# Altium schematic sheet A-03 PWR TREE.SchDoc
size 614 x 462 mm; Address1: 350W 9th Ave; Address2: Suite 206; Address3: Escondido CA 92025; Address4: United States; Revision: -; ENG_APP_DATE: --/--/--; DSN_APP_DATE: --/--/--; CHK_APP_DATE: --/--/--
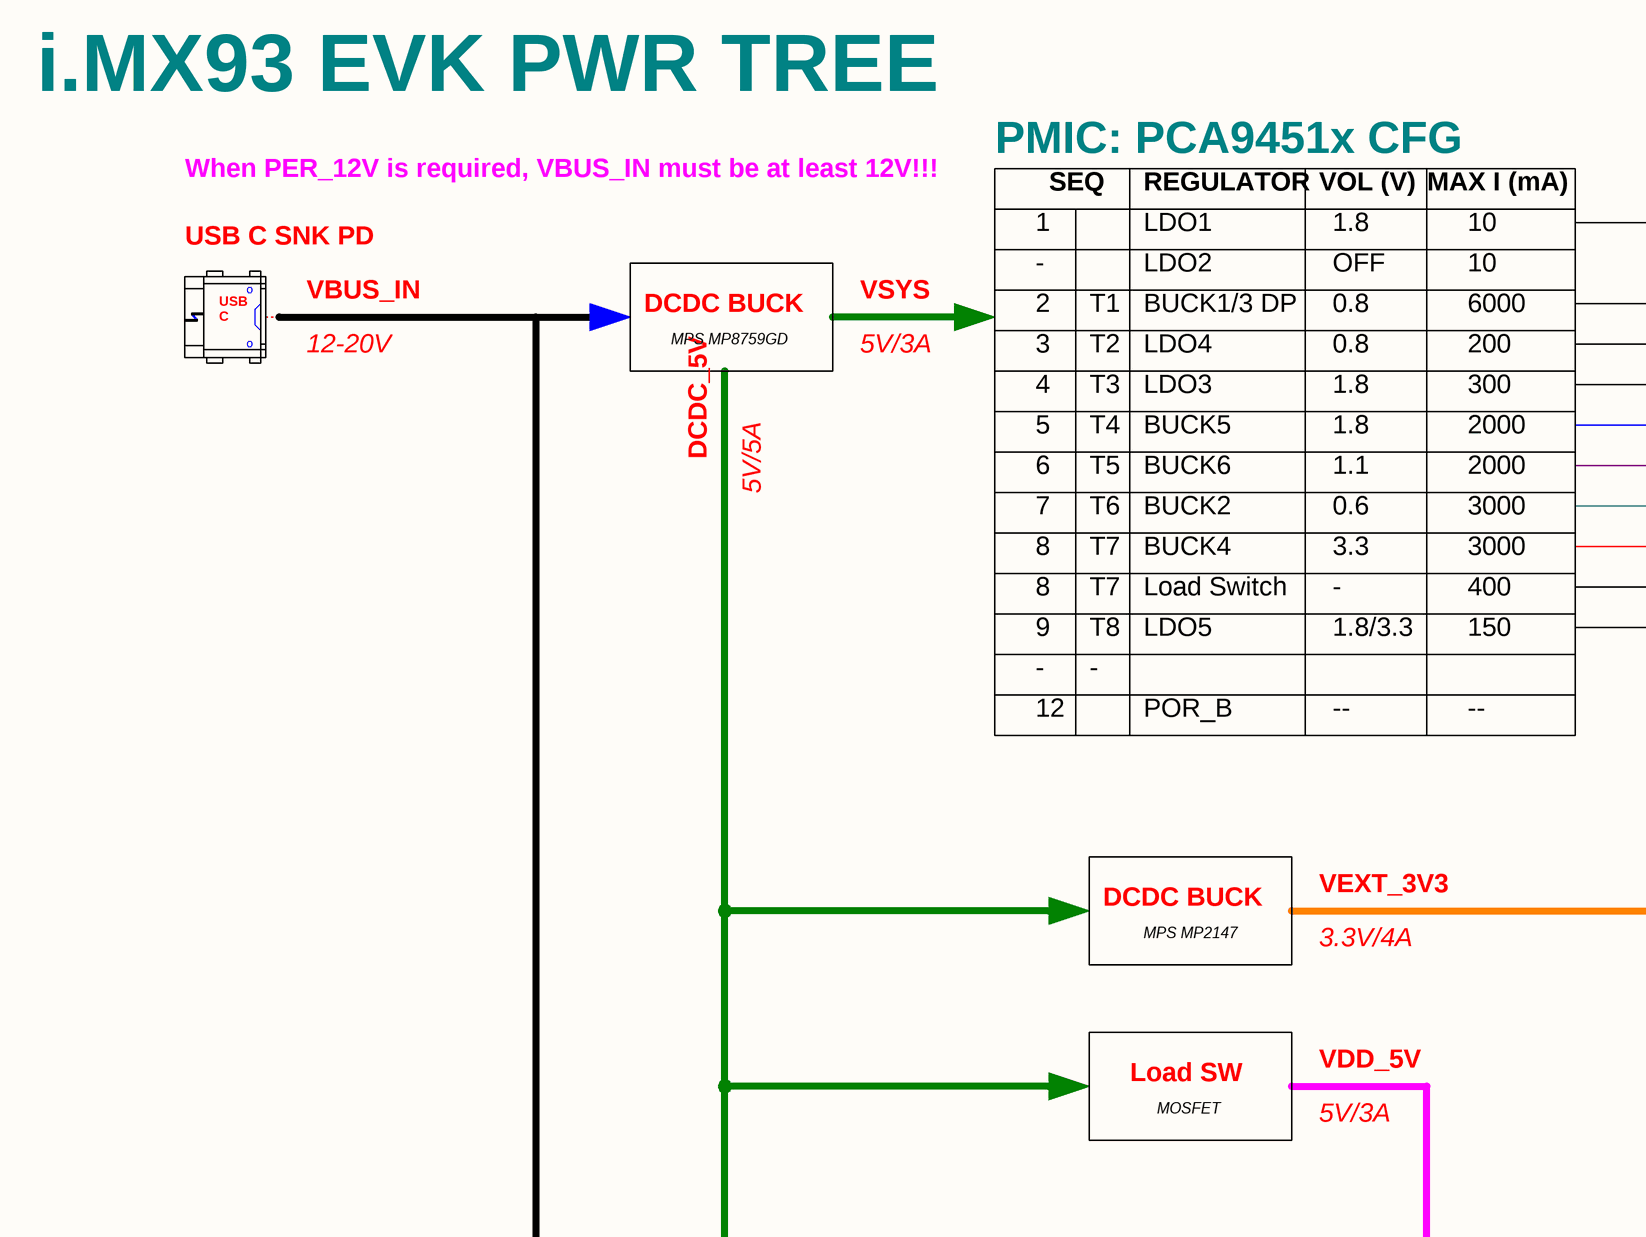
[diagram p0: A-03 PWR TREE.SchDoc, top left]
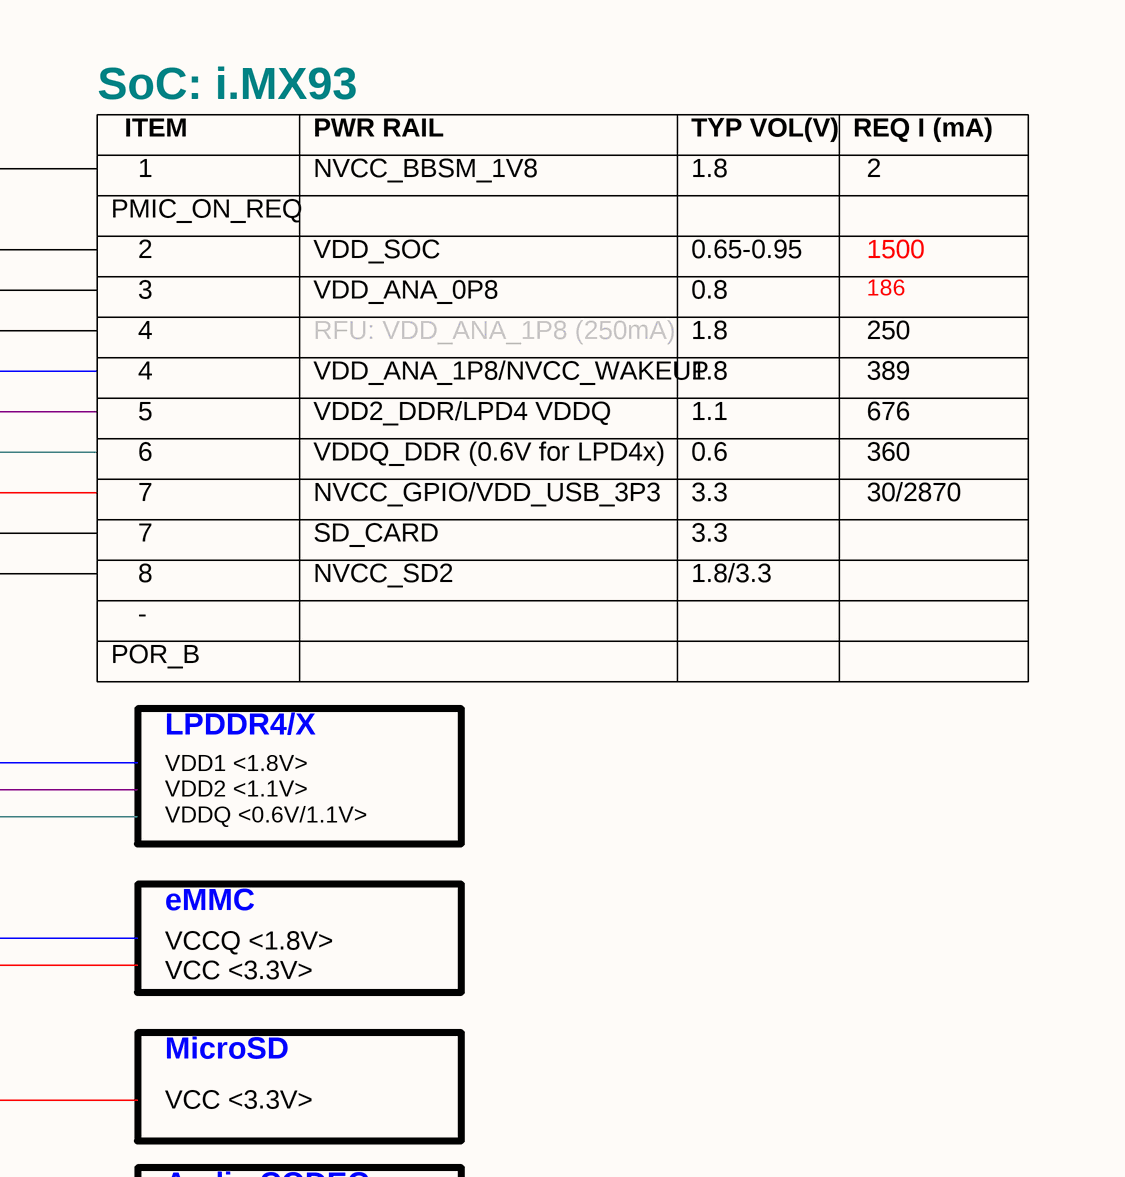
[diagram p1: A-03 PWR TREE.SchDoc, top right]
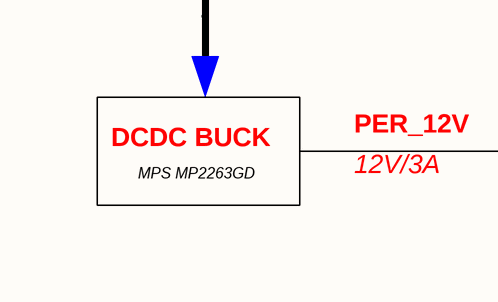
[diagram p2: A-03 PWR TREE.SchDoc, bottom left]
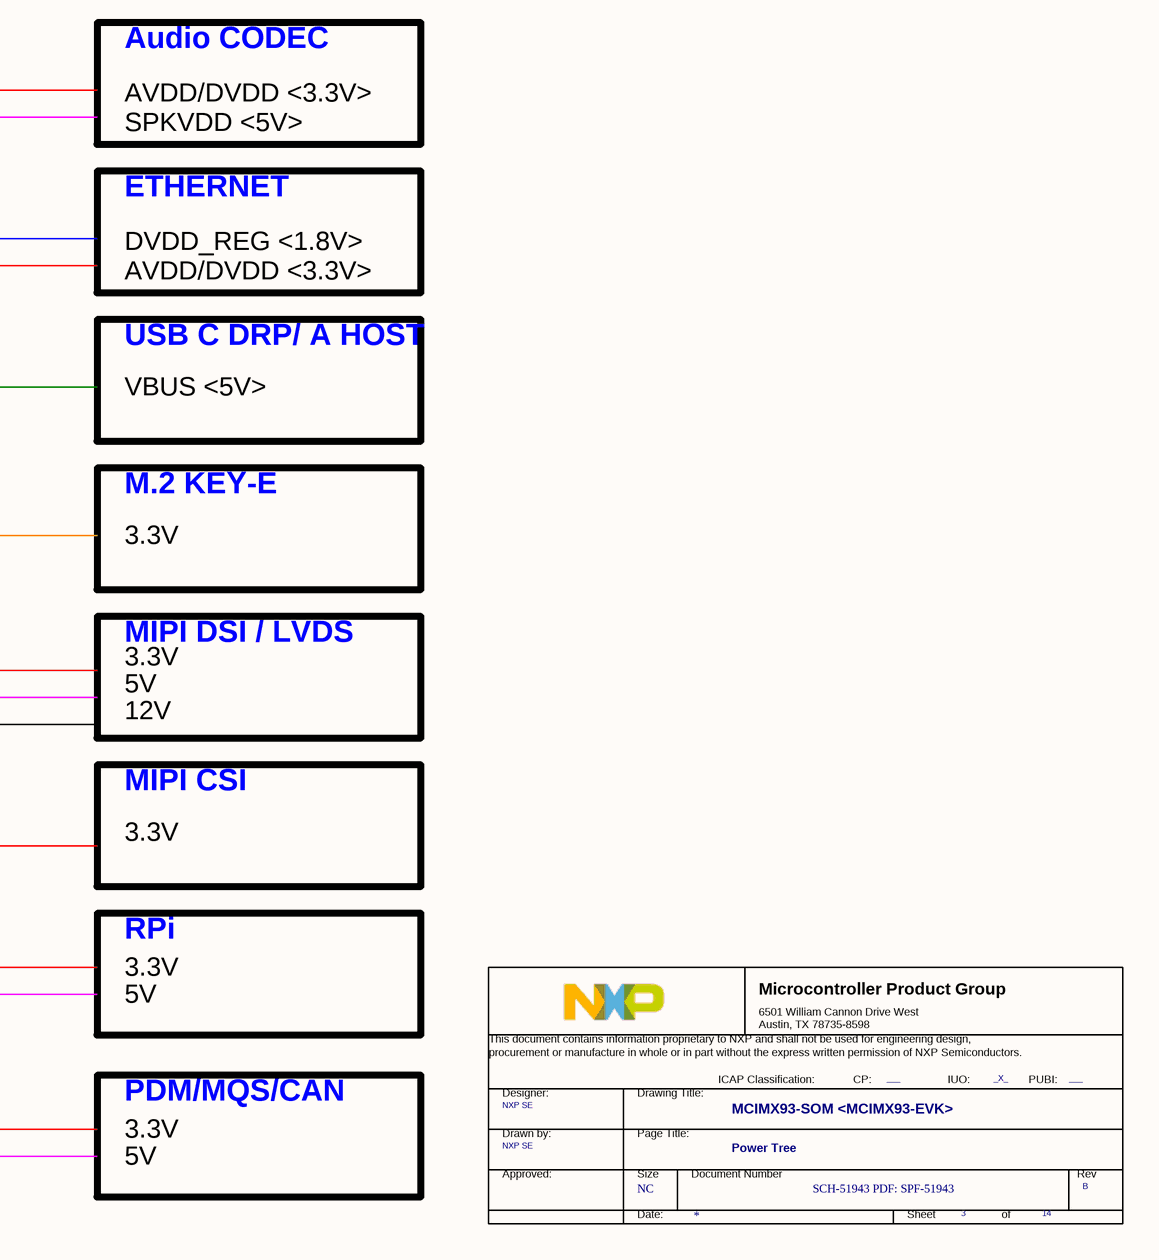
[diagram p3: A-03 PWR TREE.SchDoc, bottom right]

## Parts
*  Doc: SCH-51943 PDF: SPF-51943  RevCode: B  Title: MCIMX93-SOM <MCIMX93-EVK>  Page Size: NC  Page Number: 3  Page Count: 14  PageTitle: Power Tree  Designer: NXP SE  PUBI: ___  FIUO: _X_  (hidden comment: TitleBlock_MCPG)  (graphical)

## Notes on the sheet
- i.MX93 EVK PWR TREE
- PMIC: PCA9451x CFG
- SoC: i.MX93
- When PER_12V is required, VBUS_IN must be at least 12V!!!
- 1
- SEQ
- REGULATOR
- LDO1
- VOL (V)
- 1.8
- MAX I (mA)
- 10
- ITEM
- PWR RAIL
- NVCC_BBSM_1V8
- TYP VOL(V)
- REQ I (mA)
- 2
- USB C SNK PD
- VBUS_IN
- VSYS
- -
- LDO2
- OFF
- PMIC_ON_REQ
- USB C
  PD
- 12-20V
- DCDC BUCK
- MPS MP8759GD
- 5V/3A
- 3
- T2
- T1
- BUCK1/3 DP
- LDO4
- 0.8
- 6000
- 200
- VDD_SOC
- VDD_ANA_0P8
- 0.65-0.95
- 1500
- 186
- 4
- 5
- T4
- T3
- LDO3
- BUCK5
- 2000
- 300
- VDD_ANA_1P8/NVCC_WAKEUP
- RFU: VDD_ANA_1P8 (250mA)
- 389
- 250
- DCDC_5V
- 5V/5A
- 6
- T5
- BUCK6
- 1.1
- VDD2_DDR/LPD4 VDDQ
- 676
- 8
- 7
- T7
- T6
- BUCK2
- BUCK4
- 3.3
- 0.6
- 3000
- VDDQ_DDR (0.6V for LPD4x)
- NVCC_GPIO/VDD_USB_3P3
- 30/2870
- 360
- 9
- T8
- Load Switch
- LDO5
- 1.8/3.3
- 400
- 150
- SD_CARD
- NVCC_SD2
- 12
- POR_B
- --
- LPDDR4/X
- VEXT_3V3
- VDD1 <1.8V>
  VDD2 <1.1V>
  VDDQ <0.6V/1.1V>
- MPS MP2147
- 3.3V/4A
- eMMC
- VCCQ <1.8V>
  VCC <3.3V>
- Load SW
- MOSFET
- VDD_5V
- MicroSD
- VCC <3.3V>
- Audio CODEC
- AVDD/DVDD <3.3V>
  SPKVDD <5V>
- ETHERNET
- DVDD_REG <1.8V>
  AVDD/DVDD <3.3V>
- USB C DRP/ A HOST
- VBUS <5V>
- M.2 KEY-E
- 3.3V
- MIPI DSI / LVDS
- PER_12V
- 12V
- 5V
- MPS MP2263GD
- 12V/3A
- MIPI CSI
- RPi
- PDM/MQS/CAN
- REVISION
- DESCRIPTION
- DATE
- APPROVED
- F
- E
- D
- C
- B
- PROJECT:
- REV.
- ENG:
- APPROVALS
- PROJECT
- JordanDSP LLC <https://www.jordandsp.com>
- Envision Excellence
- SHT.
- A
- DSN:
- CHK:
- REFERENCE ITEMS
- PRJ VCS REVISION:
- TITLE
- DOC VCS REVISION:
- MODIFIED DATE:
- BOM:
- FAB DWG:
- FIRMWARE:
- ASSY DWG:
- SCALE:
- SIZE
- CAGE CODE
- FILE NAME
- DWG NO.
- PAGE
- PRODUCT REV
- OF
- (in symbol TitleBlock_MCPG) Microcontroller Product Group; 6501 William Cannon Drive West / Austin, TX 78735-8598; This document contains information proprietary to NXP and shall not be used for engineering design,; procurement or manufacture in whole or in part without the express written permission of NXP Semiconductors.; ICAP Classification:; CP:; IUO:; PUBI:; Designer:; Drawing Title:; Drawn by:; Page Title:; Approved:; Size; Document Number; Rev; Date:; Sheet; of

## Library data of the parts
* = TitleBlock_MCPG: OrgAddr1: NO. 192 Liangjing Rd. Pudong New Area, ShangHai; OrgName: NXP Semiconductor; Page Create Date: March  8, 1995; DrawnBy: NXP SE; FCP: ___; Page Modify Date: *